# Altium schematic sheet CH32V208W-NFC-R0-1v5.SchDoc
size 342 x 259 mm
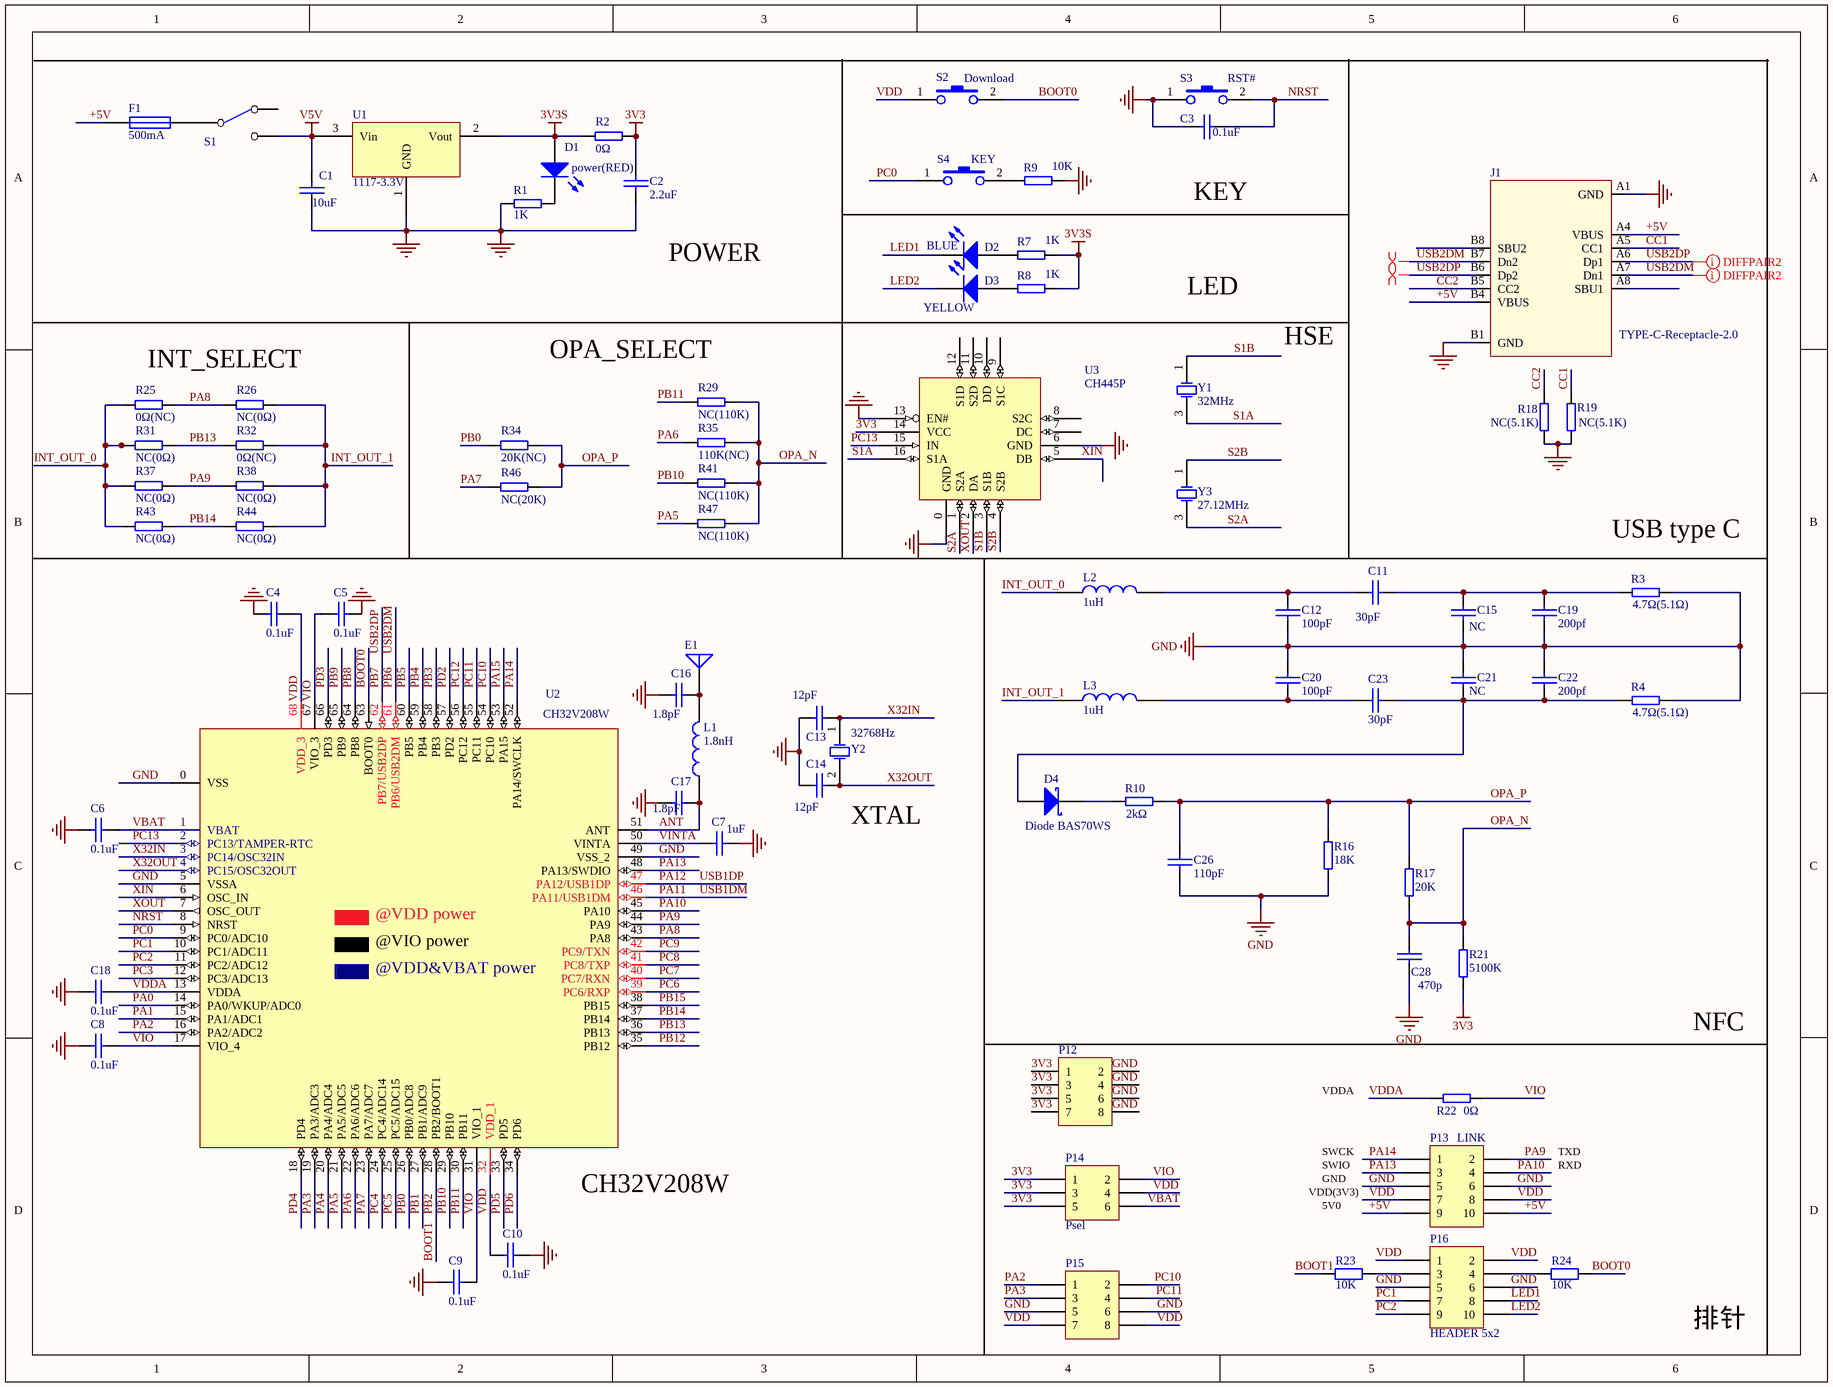
[diagram p0: CH32V208W-NFC-R0-1v5.SchDoc]

## Parts
C1  10uF  [3216_C]
C2  2.2uF  [0603_C]
C3  0.1uF  [0603_C]
C4  0.1uF  [0603_C]
C5  0.1uF  [0603_C]
C6  0.1uF  [0603_C]
C7  1uF  [0603_C]
C8  0.1uF  [0603_C]
C9  0.1uF  [0603_C]
C10  0.1uF  [0603_C]
C11  30pF  [0603_C]
C12  100pF  [0603_C]
C13  12pF  [0603_C]
C14  12pF  [0603_C]
C15  NC  [0603_C]
C16  1.8pF  [0603_C]
C17  1.8pF  [0603_C]
C18  0.1uF  [0603_C]
C19  200pf  [0603_C]
C20  100pF  [0603_C]
C21  NC  [0603_C]
C22  200pf  [0603_C]
C23  30pF  [0603_C]
C26  110pF  [0603_C]
C28  470p  [0603_C]
D1  power(RED)  [0603+]
D2  BLUE  [0603+]
D3  YELLOW  [0603+]
D4  Diode BAS70WS  [3528+]
E1  ANTENNA  [ANT-F-1-2.4G-1.6mmFR4]  (value not drawn)
F1  500mA  [0603]
J1  TYPE-C-Receptacle-2.0  [TYPE-C-Receptacle-2.0]
L1  1.8nH  [0603]
L2  1uH  [0805]
L3  1uH  [0805]
P12  Header 4X2  [IDC8-2.54mm]  (value not drawn)
P13  LINK  [IDC10-2.54mm]
P14  Psel  [IDC6-2.54mm]
P15  Header 4X2  [IDC8-2.54mm]  (value not drawn)
P16  HEADER 5x2  [IDC10-2.54mm]
R1  1K  [0603]
R2  0Ω  [0603]
R3  4.7Ω(5.1Ω)  [0603]
R4  4.7Ω(5.1Ω)  [0603]
R7  1K  [0603]
R8  1K  [0603]
R9  10K  [0603]
R10  2kΩ  [0603]
R16  18K  [0603]
R17  20K  [0603]
R18  NC(5.1K)  [0603]
R19  NC(5.1K)  [0603]
R21  5100K  [0603]
R22  0Ω  [0603]
R23  10K  [0603]
R24  10K  [0603]
R25  0Ω(NC)  [0603]
R26  NC(0Ω)  [0603]
R29  NC(110K)  [0603]
R31  NC(0Ω)  [0603]
R32  0Ω(NC)  [0603]
R34  20K(NC)  [0603]
R35  110K(NC)  [0603]
R37  NC(0Ω)  [0603]
R38  NC(0Ω)  [0603]
R41  NC(110K)  [0603]
R43  NC(0Ω)  [0603]
R44  NC(0Ω)  [0603]
R46  NC(20K)  [0603]
R47  NC(110K)  [0603]
S1  SW SPDT  [SW1]  (value not drawn)
S2  Download  [SMD_6.1x3.65x2.5mm-KEY]
S3  RST#  [SMD_6.1x3.65x2.5mm-KEY]
S4  KEY  [SMD_6.1x3.65x2.5mm-KEY]
U1  1117-3.3V  [SOT-223]
U2  CH32V208W  [QFN68_8x8]
U3  CH445P  [QFN16_3X3]
Y1  32MHz  [XT3225]
Y2  32768Hz  [FC-135]
Y3  27.12MHz  [XT3225]

## Nets
3V3: C2.1 P12.1 P12.3 P12.5 P12.7 P14.1 P14.3 P14.5 R2.1 R21.1 U3.14(VCC)
3V3S: D1.1(A) R2.2 R7.1 R8.1 U1.2(Vout)
GND: C1.2 C2.2 C3.1 C4.2 C5.1 C6.2 C7.2 C8.2 C9.2 C10.1 C12.1 C13.1 C14.1 C15.1 C16.1 C17.1 C18.2 C19.1 C20.2 C21.2 C22.2 C26.1 C28.1 J1.A1(GND) J1.B1(GND) P12.2 P12.4 P12.6 P12.8 P13.5 P13.6 P15.5 P15.6 P16.5 P16.6 R1.1 R3.2 R4.2 R9.1 R16.1 R18.2 R19.2 S3.1 U1.1(GND) U2.0(VSS) U2.5(VSSA) U2.49(VSS_2) U3.0(GND) U3.6(GND) U3.13(EN#)
V5V: C1.1 S1.2(NC) U1.3(Vin)
+5V: F1.1 J1.A4(VBUS) J1.B4(VBUS) P13.9 P13.10
ANT: C17.2 L1.1 U2.51(ANT)
BOOT0: R24.2 S2.2 U2.63(BOOT0)
BOOT1: R23.1 U2.28(PB2/BOOT1)  [also labelled PB2]
CC1: J1.A5(CC1) R19.1
CC2: J1.B5(CC2) R18.1
INT_OUT_0: L2.1 R25.2 R31.2 R37.2 R43.2
INT_OUT_1: L3.1 R26.1 R32.1 R38.1 R44.1
LED1: D2.2(K) P16.8
LED2: D3.2(K) P16.10
NRST: C3.2 S3.2 U2.8(NRST)
OPA_N: C28.2 R17.1 R21.2 R29.1 R35.1 R41.1 R47.1
OPA_P: C26.2 R10.2 R16.2 R17.2 R34.1 R46.1
PA0: U2.14(PA0/WKUP/ADC0)
PA1: U2.15(PA1/ADC1)
PA2: P15.1 U2.16(PA2/ADC2)
PA3: P15.3 U2.19(PA3/ADC3)
PA4: U2.20(PA4/ADC4)
PA5: R47.2 U2.21(PA5/ADC5)
PA6: R35.2 U2.22(PA6/ADC6)
PA7: R46.2 U2.23(PA7/ADC7)
PA8: R25.1 R26.2 U2.43(PA8)
PA9: P13.2 R37.1 R38.2 U2.44(PA9)
PA10: P13.4 U2.45(PA10)
PA11: U2.46(PA11/USB1DM)  [also labelled USB1DM]
PA12: U2.47(PA12/USB1DP)  [also labelled USB1DP]
PA13: P13.3 U2.48(PA13/SWDIO)
PA14: P13.1 U2.52(PA14/SWCLK)
PA15: U2.53(PA15)
PB0: R34.2 U2.26(PB0/ADC8)
PB1: U2.27(PB1/ADC9)
PB3: U2.58(PB3)
PB4: U2.59(PB4)
PB5: U2.60(PB5)
PB6: J1.A7(Dn1) J1.B7(Dn2) U2.61(PB6/USB2DM)  [also labelled USB2DM]
PB7: J1.A6(Dp1) J1.B6(Dp2) U2.62(PB7/USB2DP)  [also labelled USB2DP]
PB8: U2.64(PB8)
PB9: U2.65(PB9)
PB10: R41.2 U2.29(PB10)
PB11: R29.2 U2.30(PB11)
PB12: U2.35(PB12)
PB13: R31.1 R32.2 U2.36(PB13)
PB14: R43.1 R44.2 U2.37(PB14)
PB15: U2.38(PB15)
PC0: S4.1 U2.9(PC0/ADC10)
PC1: P16.7 U2.10(PC1/ADC11)
PC2: P16.9 U2.11(PC2/ADC12)
PC3: U2.12(PC3/ADC13)
PC4: U2.24(PC4/ADC14)
PC5: U2.25(PC5/ADC15)
PC6: U2.39(PC6/RXP)
PC7: U2.40(PC7/RXN)
PC8: U2.41(PC8/TXP)
PC9: U2.42(PC9/TXN)
PC10: P15.2 U2.54(PC10)
PC11: P15.4 U2.55(PC11)
PC12: U2.56(PC12)
PC13: U2.2(PC13/TAMPER-RTC) U3.15(IN)
PD2: U2.57(PD2)
PD3: U2.66(PD3)
PD4: U2.18(PD4)
PD5: U2.33(PD5)
PD6: U2.34(PD6)
S1A: U3.16(S1A) Y1.3(OSC2)
S1B: U3.3(S1B) Y1.1(OSC1)
S2A: U3.1(S2A) Y3.3(OSC2)
S2B: U3.4(S2B) Y3.1(OSC1)
VBAT: C6.1 P14.6 U2.1(VBAT)
VDD: C4.1 C10.2 P13.7 P13.8 P14.4 P15.7 P15.8 P16.1 P16.2 S2.1 U2.32(VDD_1) U2.68(VDD_3)
VDDA: C18.1 R22.2 U2.13(VDDA)
VINTA: C7.1 U2.50(VINTA)
VIO: C5.2 C8.1 C9.1 P14.2 R22.1 U2.17(VIO_4) U2.31(VIO_1) U2.67(VIO_3)
X32IN: C13.2 U2.3(PC14/OSC32IN) Y2.1(OSC1)
X32OUT: C14.2 U2.4(PC15/OSC32OUT) Y2.2(OSC2)
XIN: U2.6(OSC_IN) U3.5(DB)
XOUT: U2.7(OSC_OUT) U3.2(DA)
NetC11_1: C11.1 C12.2 L2.2
NetC11_2: C11.2 C15.2 C19.2 R3.1
NetC16_2: C16.2 E1.1(A) L1.2
NetC20_1: C20.1 C23.1 L3.2
NetC21_1: C21.1 C22.1 C23.2 D4.1(A) R4.1
NetD1_2: D1.2(K) R1.2
NetD2_1: D2.1(A) R7.2
NetD3_1: D3.1(A) R8.2
NetD4_2: D4.2(K) R10.1
NetF1_2: F1.2 S1.1(COMMON)
NetP16_3: P16.3 R23.2
NetP16_4: P16.4 R24.1
NetR9_2: R9.2 S4.2

Not connected (* = marked no-connect by the designer): J1 A8(SBU1) B8(SBU2); S1 3(NO); U3 7(DC) 8(S2C) 9(S1C) 10(DD) 11(S2D) 12(S1D)

## Layout directives
differential pair: PB6, PB7

## Notes on the sheet
- KEY
- POWER
- LED
- INT_SELECT
- (near R29) OPA_SELECT
- HSE
- (near R3) USB type C
- XTAL
- NFC
- VDDA
- (near U2) CH32V208W
- VDD(3V3)
- SWCK
- SWIO
- GND
- TXD
- RXD
- 5V0
- 排针
- (in symbol CH32V208W) @VDD power; @VIO power; @VDD&VBAT power

## Library data of the parts
C1-C23 C26 C28 = CAP: Capacitor
D1-D3 = LED0: Typical INFRARED GaAs LED; Published: 8-Jun-2000; LatestRevisionDate: 08-Jul-2005; LatestRevisionNote: Mech Layer 1 removed.; PackageReference: LED-0; Publisher: Altium Limited; PackageDescription: LED; 2 Leads
D4 = Diode BAS70: Silicon AF Schottky Diode for High-Speed Switching; ComponentLink1Description: Manufacturer Link; ComponentLink1URL: http://www.infineon.com/; ComponentLink2Description: Datasheet; ComponentLink2URL: http://www.infineon.com/upload/Document/cmc_upload/documents/009/382/bas40_bas140series_1.pdf
E1 = ANTENNA: Generic Antenna
F1 = FUSE1: Fuse
J1 = TYPE-C-Receptacle-2.0: Type-C USB2.0 母座
L1-L3 = INDUCTOR
P12 P15 = Header 4X2: Header, 4-Pin, Dual row; LatestRevisionDate: 17-Jul-2002; LatestRevisionNote: Re-released for DXP Platform.; Publisher: Altium Limited
P13 = Header 5X2H: Header, 5-Pin, Dual row, Right Angle; LatestRevisionDate: 17-Jul-2002; LatestRevisionNote: Re-released for DXP Platform.; Publisher: Altium Limited
P14 = Header 3X2H: Header, 3-Pin, Dual row, Right Angle; LatestRevisionDate: 17-Jul-2002; LatestRevisionNote: Re-released for DXP Platform.; Publisher: Altium Limited
P16 = HEADER 5x2: Header, 5-Pin, Dual row
R1-R4 R7-R10 R16-R19 R21 R25 R26 R29 R31 R32 R34 R35 R37 R38 R41 R43 R44 R46 R47 = RES
R22 = R
R23 R24 = Res2: Resistor
S2-S4 = KEY1
U2 = CH32V208W: RISC-V BLE5.3 MCU, 10M Ethernet, 2*USB, CAN
U3 = CH445P: QPDT Low resistance mux 2:1 Analog switches with enable for 3.3V
Y1-Y3 = XTAL: Crystal Oscillator; Published: 8-Jun-2000; LatestRevisionDate: 17-Jul-2002; LatestRevisionNote: Re-released for DXP Platform.; PackageReference: R38; Publisher: Altium Limited; PackageDescription: Crystal, Thru-Hole; 2 Leads; Body 3.1 x 8.2 mm (Dia.xH)